# EAGLE design TRHHCHO_datalogger (EAGLE 9.1.1)
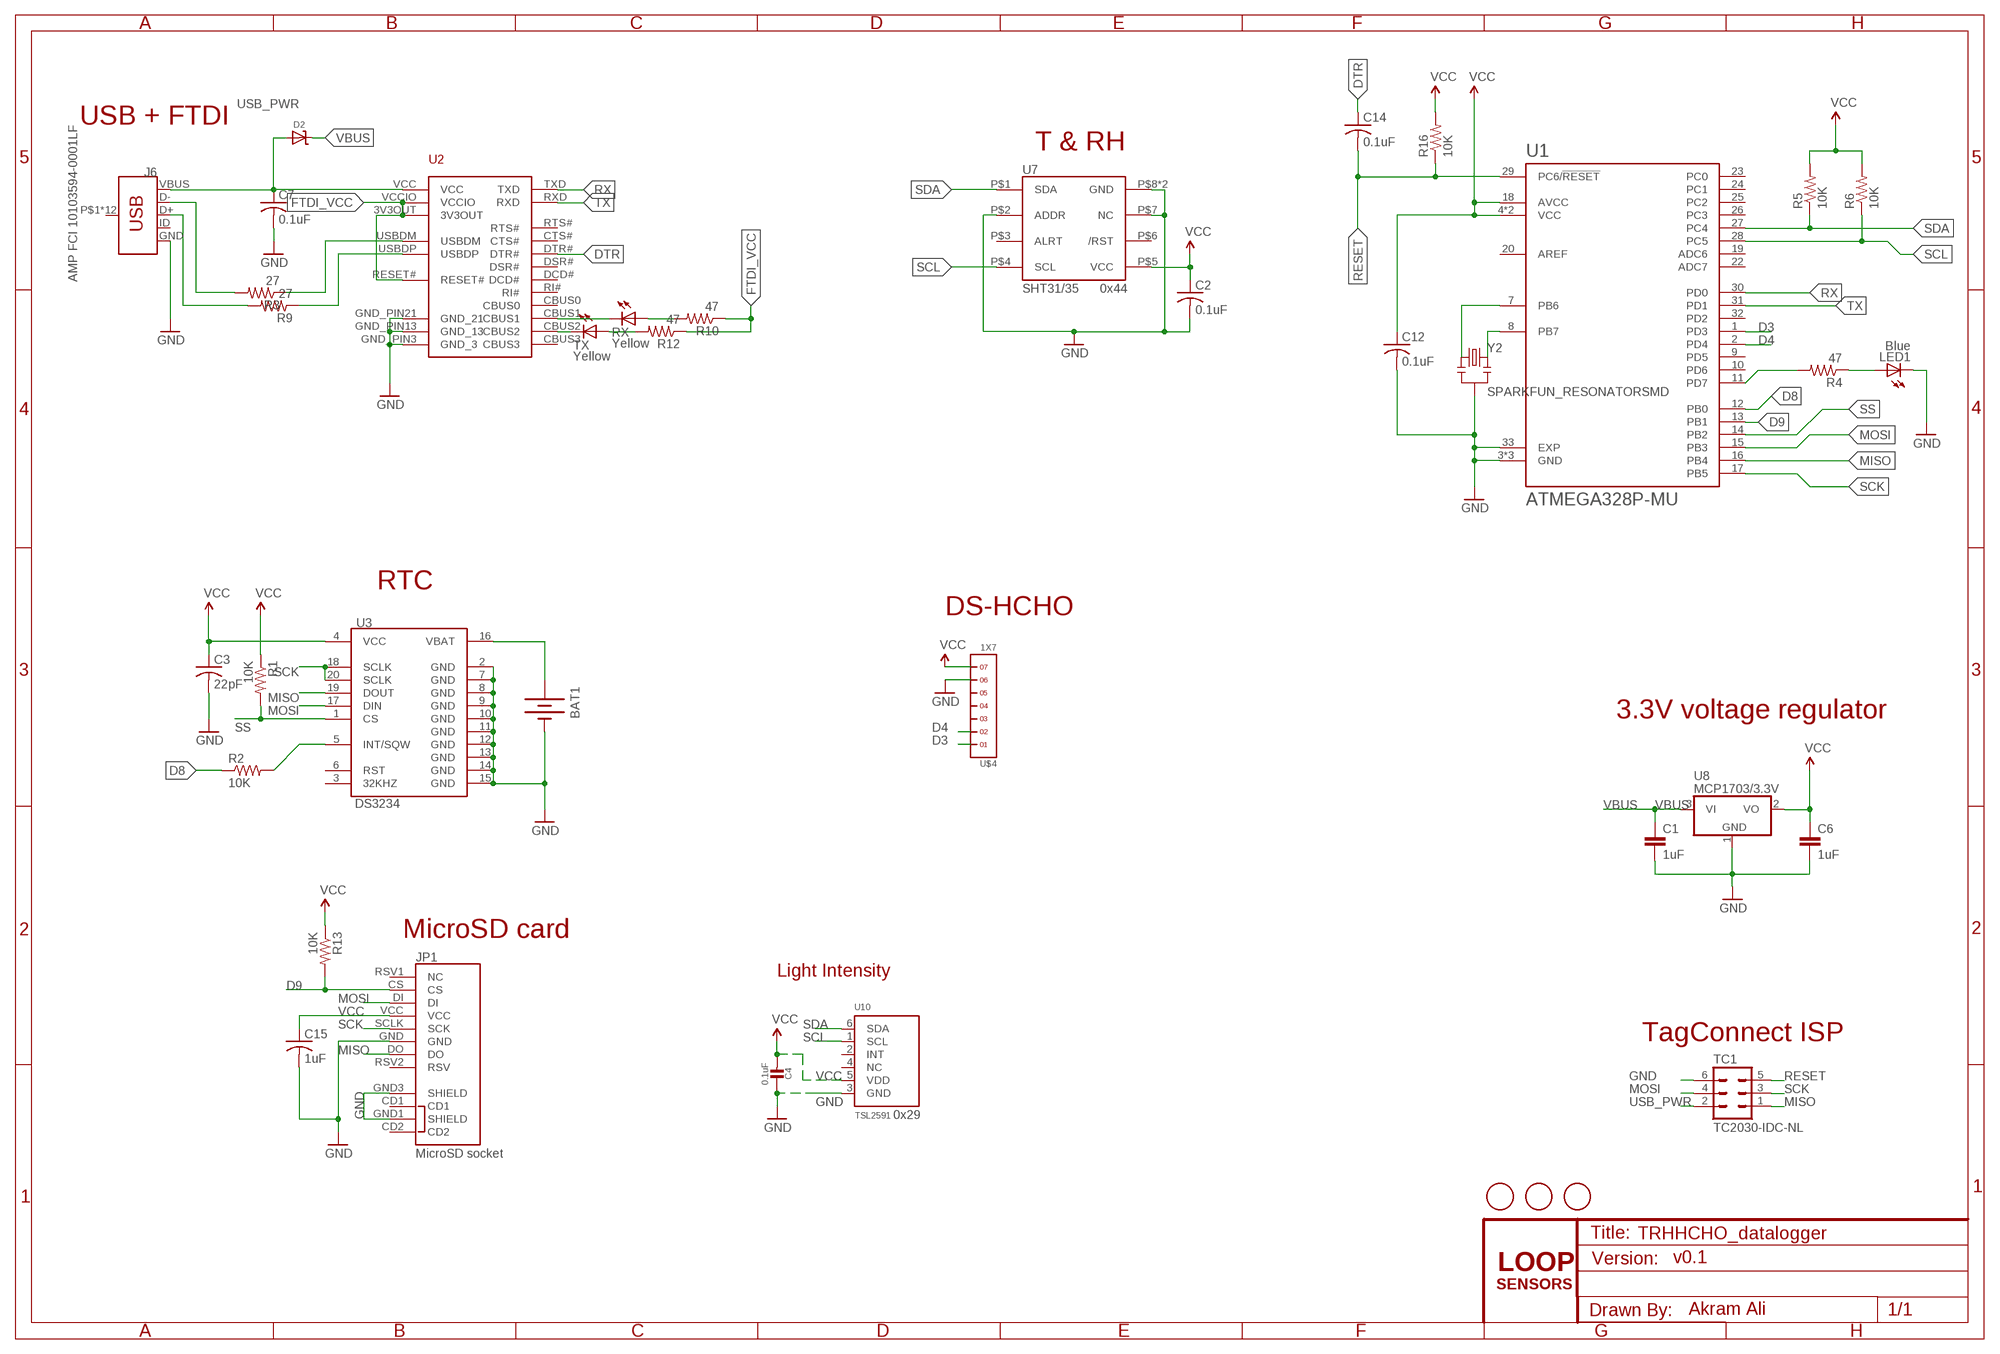
[diagram p0: schematic, sheet 1]

## Parts
BAT1  BATTERY12MM  [BATTCON_12MM]
C1  1uF  CAP0805  [0805]
C2  0.1uF  C-USC0402  [C0402]
C3  22pF  C-USC0402  [C0402]
C4  0.1uF  MICROBUILDER_CAP_CERAMIC_0402MP  [MICROBUILDER__0402MP]
C6  1uF  CAP0805  [0805]
C7  0.1uF  C-USC0402  [C0402]
C12  0.1uF  C-USC0402  [C0402]
C14  0.1uF  C-USC0402  [C0402]
C15  1uF  C-USC0402  [C0402]
D2  MICROBUILDER_DIODE-SCHOTTKYSOD-123  [MICROBUILDER_SOD-123]
J6  AMP FCI 10103594-0001LF  USB_MICRO-B_HALF_PTH  [USB-MICROB-PTH]
JP1  MicroSD socket  USD-SOCKETNEW  [MICRO-SD-SOCKET-PP]
LED1  Blue  LEDCHIPLED_0805  [CHIPLED_0805]
R1  10K  R-US_R0402  [R0402]
R2  10K  R-US_R0402  [R0402]
R3  27  R-US_R0402  [R0402]
R4  47  R-US_R0402  [R0402]
R5  10K  R-US_R0402  [R0402]
R6  10K  R-US_R0402  [R0402]
R9  27  R-US_R0402  [R0402]
R10  47  R-US_R0402  [R0402]
R12  47  R-US_R0402  [R0402]
R13  10K  R-US_R0402  [R0402]
R16  10K  R-US_R0402  [R0402]
RX  Yellow  LEDCHIPLED_0805  [CHIPLED_0805]
TC1  TC2030-IDC-NL  [TC2030-IDC-NL]
TX  Yellow  LEDCHIPLED_0805  [CHIPLED_0805]
U1  ATMEGA328P-MU  [QFN50P500X500X100-33N]
U2  FT231XQ-R  [FTDI_FT231XQ-R_PACKAGE]
U3  DS3234  [DS3234]
U7  SHT31/35  SHT31-DIS  [SHT3X]
U8  MCP1703/3.3V  MCP1703CB  [SOT23]
U10  TSL2591  LIGHT_TSL2591  [DFN6_TAOS]
U$1  FIDUCIAL  [FIDUCIAL_1MM]
U$2  FIDUCIAL  [FIDUCIAL_1MM]
U$3  FIDUCIAL  [FIDUCIAL_1MM]
U$4  1X7  [1X7]
Y2  SPARKFUN_RESONATORSMD  [SPARKFUN_RESONATOR-SMD]

## Nets
D3: U1.1(PD3) U$4.1
D4: U1.2(PD4) U$4.2
D8: R2.1 U1.12(PB0)
D9: JP1.CS R13.2 U1.13(PB1)
DTR: C14.1 U2.DTR#
FTDI_VCC: R10.1 R12.1 U2.3V3OUT U2.RESET# U2.VCCIO
GND: BAT1.GND(-) C1.2 C2.2 C3.2 C4.1 C6.2 C7.2 C12.2 C15.2 J6.GND JP1.GND JP1.GND1(SHIELD) JP1.GND3(SHIELD) LED1.C TC1.6 U1.3(GND) U1.5(GND) U1.21(GND) U1.33(EXP) U2.GND_PIN3(GND_3) U2.GND_PIN13(GND_13) U2.GND_PIN21(GND_21) U3.2(GND) U3.7(GND) U3.8(GND) U3.9(GND) U3.10(GND) U3.11(GND) U3.12(GND) U3.13(GND) U3.14(GND) U3.15(GND) U7.P$2(ADDR) U7.P$7(NC) U7.P$8(GND) U7.PAD(GND) U8.1(GND) U10.3(GND) U$4.6 Y2.2
MISO: JP1.DO TC1.1 U1.16(PB4) U3.19(DOUT)
MOSI: JP1.DI TC1.4 U1.15(PB3) U3.17(DIN)
N$1: R4.2 U1.11(PD7)
N$2: R2.2 U3.5(INT/SQW)
N$3: LED1.A R4.1
N$4: U1.8(PB7) Y2.3
N$5: U1.7(PB6) Y2.1
N$8: BAT1.PWR@1(+) U3.16(VBAT)
N$17: RX.C U2.CBUS1
N$18: TX.C U2.CBUS2
N$25: R3.1 U2.USBDM
N$26: R9.1 U2.USBDP
N$27: R10.2 RX.A
N$29: R12.2 TX.A
N$32: J6.D- R3.2
N$33: J6.D+ R9.2
RESET: C14.2 R16.1 TC1.5 U1.29(PC6/!RESET)
RX: U1.30(PD0) U2.TXD
SCK: JP1.SCLK(SCK) TC1.3 U1.17(PB5) U3.18(SCLK) U3.20(SCLK)
SCL: R6.1 U1.28(PC5) U7.P$4(SCL) U10.1(SCL)
SDA: R5.1 U1.27(PC4) U7.P$1(SDA) U10.6(SDA)
SS: R1.2 U1.14(PB2) U3.1(CS)
TX: U1.31(PD1) U2.RXD
USB_PWR: C7.1 D2.A J6.VBUS TC1.2 U2.VCC
VBUS: C1.1 D2.C U8.3(VI)
VCC: C2.1 C3.1 C4.2 C6.1 C12.1 C15.1 JP1.VCC R1.1 R5.2 R6.2 R13.1 R16.2 U1.4(VCC) U1.6(VCC) U1.18(AVCC) U3.4(VCC) U7.P$5(VCC) U8.2(VO) U10.5(VDD) U$4.7
Unconnected: J6.ID J6.P$1(SHIELD) J6.P$2(SHIELD) J6.P$3(SHIELD) J6.P$4(SHIELD) J6.P$6(SHIELD) J6.P$8(SHIELD) J6.P$10(SHIELD) J6.P$12(SHIELD) J6.SHEILD2(SHIELD) J6.SHIELD J6.SHIELD3(SHIELD) J6.SHIELD4(SHIELD) JP1.CD1 JP1.CD2 JP1.RSV1(NC) JP1.RSV2(RSV) U1.9(PD5) U1.10(PD6) U1.19(ADC6) U1.20(AREF) U1.22(ADC7) U1.23(PC0) U1.24(PC1) U1.25(PC2) U1.26(PC3) U1.32(PD2) U2.CBUS0 U2.CBUS3 U2.CTS# U2.DCD# U2.DSR# U2.RI# U2.RTS# U3.3(32KHZ) U3.6(RST) U7.P$3(ALRT) U7.P$6(/RST) U10.2(INT) U10.4(NC) U$4.3 U$4.4 U$4.5

## Notes on the sheet
- USB + FTDI
- T & RH
- 0x44
- RTC
- DS-HCHO
- 3.3V voltage regulator
- MicroSD card
- Light Intensity
- TagConnect ISP
- 0x29
- v0.1
- LOOP
- SENSORS
- Akram Ali

## Library data of the parts
BAT1 = SparkFun-Electromechanical:BATTERY: Battery Holders Various common sizes : AA, AAA, 18650 (PRT-12895), 20mm coin cell and 12mm coin cell. 20MM_4LEGS, BATT-10373; MPN: 3000; PROD_ID: BATT-08044
C1 C6 = SparkFun-Capacitors:CAP: Capacitor Standard 0603 ceramic capacitor, and 0.1" leaded capacitor.; MPN: CC0805KKX7R7BB105
C2 C3 C7 C12 C14 C15 = adafruit:C-US: CAPACITOR, American symbol
C4 = Adafruit Feather 32u4 Bluefruit LE:MICROBUILDER_CAP_CERAMIC: Ceramic Capacitors For new designs, use the packages preceded by an '_' character since they are more reliable: The following footprints should be used on most boards: _0402 - Standard footprint for regular board layouts _0603 - Standard footprint for regular board layouts _0805 - Standard footprint for regular board layouts _1206 - Standard footprint for regular board layouts For extremely tight-pitch boards where space is at a premium, the following 'micro-pitch' footprints can be used (smaller pads, no silkscreen outline, etc.): _0402MP - Micro-pitch footprint for very dense/compact boards _0603MP - Micro-pitch footprint for very dense/compact boards _0805MP - Micro-pitch footprint for very dense/compact boards _1206MP - Micro-pitch footprint for very dense/compact boards; MPN: GRM155R71C104KA88J
D2 = Adafruit Feather 32u4 Bluefruit LE:MICROBUILDER_DIODE-SCHOTTKY
J6 = SparkFun-Connectors:USB_MICRO-B: USB Type Micro-B Connector Male/female and PTH/SMT variants SparkFun Products: SparkFun microB USB Breakout <https://www.sparkfun.com/products/12035> SparkFun USB microB Plug Breakout <https://www.sparkfun.com/products/10031> SparkFun ESP8266 Thing <https://www.sparkfun.com/products/13231>; PROD_ID: CONN-13711
JP1 = SparkFun-Connectors:USD-SOCKET: microSD Socket Push-push type uSD socket. Schematic element and footprint production proven. Spark Fun Electronics SKU : PRT-00127. tDoc lines correctly indicate media card edge positions when inserting (unlocked, locked, depressed). NOTE: CD1 and CD2 are connected internally; PROD_ID: CONN-07820
LED1 = adafruit:LED: LED OSRAM: - CHIPLED LG R971, LG N971, LY N971, LG Q971, LY Q971, LO R971, LY R971 LH N974, LH R974 LS Q976, LO Q976, LY Q976 LO Q996 - Hyper CHIPLED LW Q18S LB Q993, LB Q99A, LB R99A - SideLED LS A670, LO A670, LY A670, LG A670, LP A670 LB A673, LV A673, LT A673, LW A673 LH A674 LY A675 LS A676, LA A676, LO A676, LY A676, LW A676 LS A679, LY A679, LG A679 - Hyper Micro SIDELED® LS Y876, LA Y876, LO Y876, LY Y876 LT Y87S - SmartLED LW L88C, LW L88S LB L89C, LB L89S, LG L890 LS L89K, LO L89K, LY L89K LS L896, LA L896, LO L896, LY L896 - TOPLED LS T670, LO T670, LY T670, LG T670, LP T670 LSG T670, LSP T670, LSY T670, LOP T670, LYG T670 LG T671, LOG T671, LSG T671 LB T673, LV T673, LT T673, LW T673 LH T674 LS T676, LA T676, LO T676, LY T676, LB T676, LH T676, LSB T676, LW T676 LB T67C, LV T67C, LT T67C, LS T67K, LO T67K, LY T67K, LW E67C LS E67B, LA E67B, LO E67B, LY E67B, LB E67C, LV E67C, LT E67C LW T67C LS T679, LY T679, LG T679 LS T770, LO T770, LY T770, LG T770, LP T770 LB T773, LV T773, LT T773, LW T773 LH T774 LS E675, LA E675, LY E675, LS T675 LS T776, LA T776, LO T776, LY T776, LB T776 LHGB T686 LT T68C, LB T68C - Hyper Mini TOPLED® LB M676 - Mini TOPLED Santana® LG M470 LS M47K, LO M47K, LY M47K Source: http://www.osram.convergy.de/; MPN: 150080BS75000
R1-R6 R9 R10 R12 R13 R16 = adafruit:R-US_: RESISTOR, American symbol
RX = adafruit:LED: LED OSRAM: - CHIPLED LG R971, LG N971, LY N971, LG Q971, LY Q971, LO R971, LY R971 LH N974, LH R974 LS Q976, LO Q976, LY Q976 LO Q996 - Hyper CHIPLED LW Q18S LB Q993, LB Q99A, LB R99A - SideLED LS A670, LO A670, LY A670, LG A670, LP A670 LB A673, LV A673, LT A673, LW A673 LH A674 LY A675 LS A676, LA A676, LO A676, LY A676, LW A676 LS A679, LY A679, LG A679 - Hyper Micro SIDELED® LS Y876, LA Y876, LO Y876, LY Y876 LT Y87S - SmartLED LW L88C, LW L88S LB L89C, LB L89S, LG L890 LS L89K, LO L89K, LY L89K LS L896, LA L896, LO L896, LY L896 - TOPLED LS T670, LO T670, LY T670, LG T670, LP T670 LSG T670, LSP T670, LSY T670, LOP T670, LYG T670 LG T671, LOG T671, LSG T671 LB T673, LV T673, LT T673, LW T673 LH T674 LS T676, LA T676, LO T676, LY T676, LB T676, LH T676, LSB T676, LW T676 LB T67C, LV T67C, LT T67C, LS T67K, LO T67K, LY T67K, LW E67C LS E67B, LA E67B, LO E67B, LY E67B, LB E67C, LV E67C, LT E67C LW T67C LS T679, LY T679, LG T679 LS T770, LO T770, LY T770, LG T770, LP T770 LB T773, LV T773, LT T773, LW T773 LH T774 LS E675, LA E675, LY E675, LS T675 LS T776, LA T776, LO T776, LY T776, LB T776 LHGB T686 LT T68C, LB T68C - Hyper Mini TOPLED® LB M676 - Mini TOPLED Santana® LG M470 LS M47K, LO M47K, LY M47K Source: http://www.osram.convergy.de/; MPN: LG R971-KN-1
TC1 = TagConnect:TC2030-IDC: Tag-Connect In Circuit Programming & Debug Cable 6 Pin http://www.tag-connect.com
TX = adafruit:LED: LED OSRAM: - CHIPLED LG R971, LG N971, LY N971, LG Q971, LY Q971, LO R971, LY R971 LH N974, LH R974 LS Q976, LO Q976, LY Q976 LO Q996 - Hyper CHIPLED LW Q18S LB Q993, LB Q99A, LB R99A - SideLED LS A670, LO A670, LY A670, LG A670, LP A670 LB A673, LV A673, LT A673, LW A673 LH A674 LY A675 LS A676, LA A676, LO A676, LY A676, LW A676 LS A679, LY A679, LG A679 - Hyper Micro SIDELED® LS Y876, LA Y876, LO Y876, LY Y876 LT Y87S - SmartLED LW L88C, LW L88S LB L89C, LB L89S, LG L890 LS L89K, LO L89K, LY L89K LS L896, LA L896, LO L896, LY L896 - TOPLED LS T670, LO T670, LY T670, LG T670, LP T670 LSG T670, LSP T670, LSY T670, LOP T670, LYG T670 LG T671, LOG T671, LSG T671 LB T673, LV T673, LT T673, LW T673 LH T674 LS T676, LA T676, LO T676, LY T676, LB T676, LH T676, LSB T676, LW T676 LB T67C, LV T67C, LT T67C, LS T67K, LO T67K, LY T67K, LW E67C LS E67B, LA E67B, LO E67B, LY E67B, LB E67C, LV E67C, LT E67C LW T67C LS T679, LY T679, LG T679 LS T770, LO T770, LY T770, LG T770, LP T770 LB T773, LV T773, LT T773, LW T773 LH T774 LS E675, LA E675, LY E675, LS T675 LS T776, LA T776, LO T776, LY T776, LB T776 LHGB T686 LT T68C, LB T68C - Hyper Mini TOPLED® LB M676 - Mini TOPLED Santana® LG M470 LS M47K, LO M47K, LY M47K Source: http://www.osram.convergy.de/; MPN: LH R974-LP-1
U1 = ATMEGA328P-MU:ATMEGA328P-MU: ATmega Series 20 MHz 32 KB Flash 2 KB SRAM 8-Bit Microcontroller - QFN-32; AVAILABILITY: Good; DESCRIPTION: ATmega Series 20 MHz 32 KB Flash 2 KB SRAM 8-Bit Microcontroller - QFN-32; MF: Atmel; MP: ATMEGA328P-MU; PACKAGE: QFN-32 Atmel; PRICE: 2.55 USD
U2 = ftdi_ft231xq-r:FT231XQ-R: This is the 20-LD QFN package of the FTDI FT231XQ-R chip.; MPN: FT231XQ-R
U3 = SparkFun-FreqCtrl:DS3234: SPI RTC module with battery backup and internal clock.; MPN: DS3234S#
U7 = thomasb9511:SHT31-DIS; MPN: SHT31-DIS-B
U8 = linear:MCP1703: 250 mA, 16V, Low Quiescent Current LDO Regulator Source: http://ww1.microchip.com/downloads/en/DeviceDoc/22049b.pdf; MPN: MCP1703T-2502E/CB
U10 = TSL2591:LIGHT_TSL2591: TSL2591 Light-To-Digital Sensor; MPN: TSL25911FN
U$1-U$3 = adafruit:FIDUCIAL: For use by pick and place machines to calibrate the vision/machine, 1mm By microbuilder.eu
U$4 = headers(2mm):1X7
Y2 = Adafruit Feather 32u4 Bluefruit LE:SPARKFUN_RESONATOR: Resonator Small SMD resonator. This is the itty bitty 10/20MHz resonators with built in caps. CSTCE10M0G55 and CSTCE20M0V53. Footprint has been reviewed closely but hasn't been tested yet.

## Board
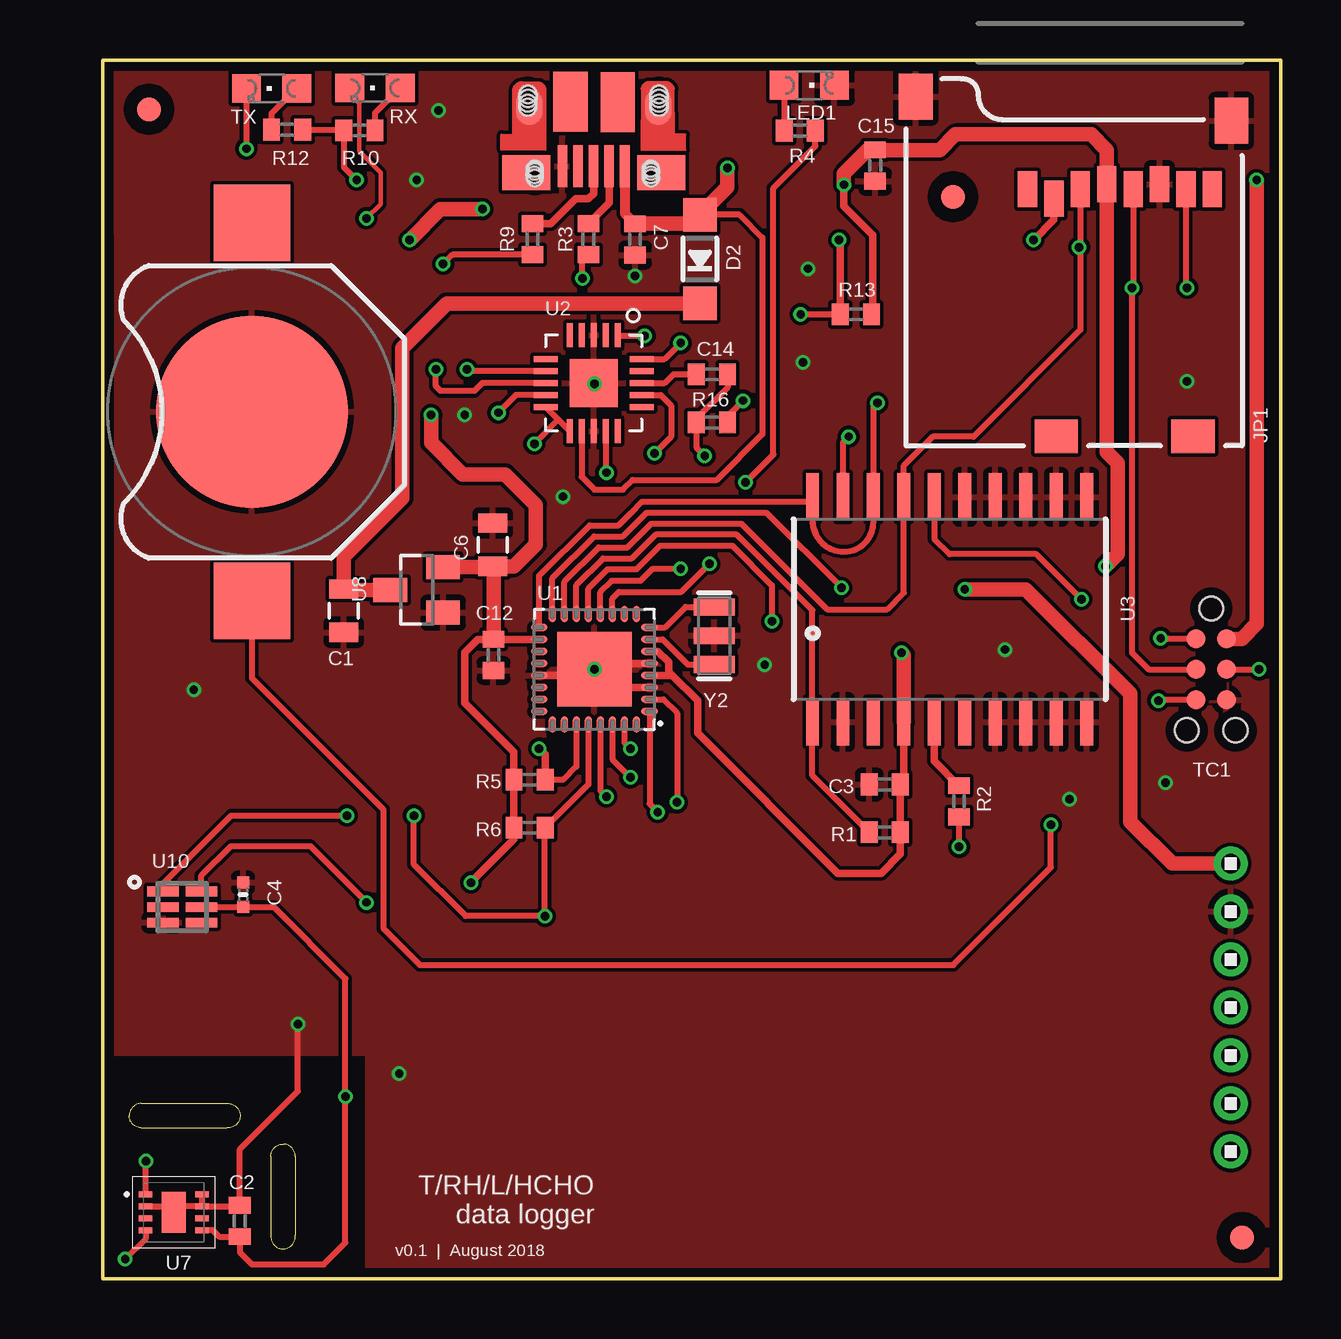
[diagram p1: board, top side]
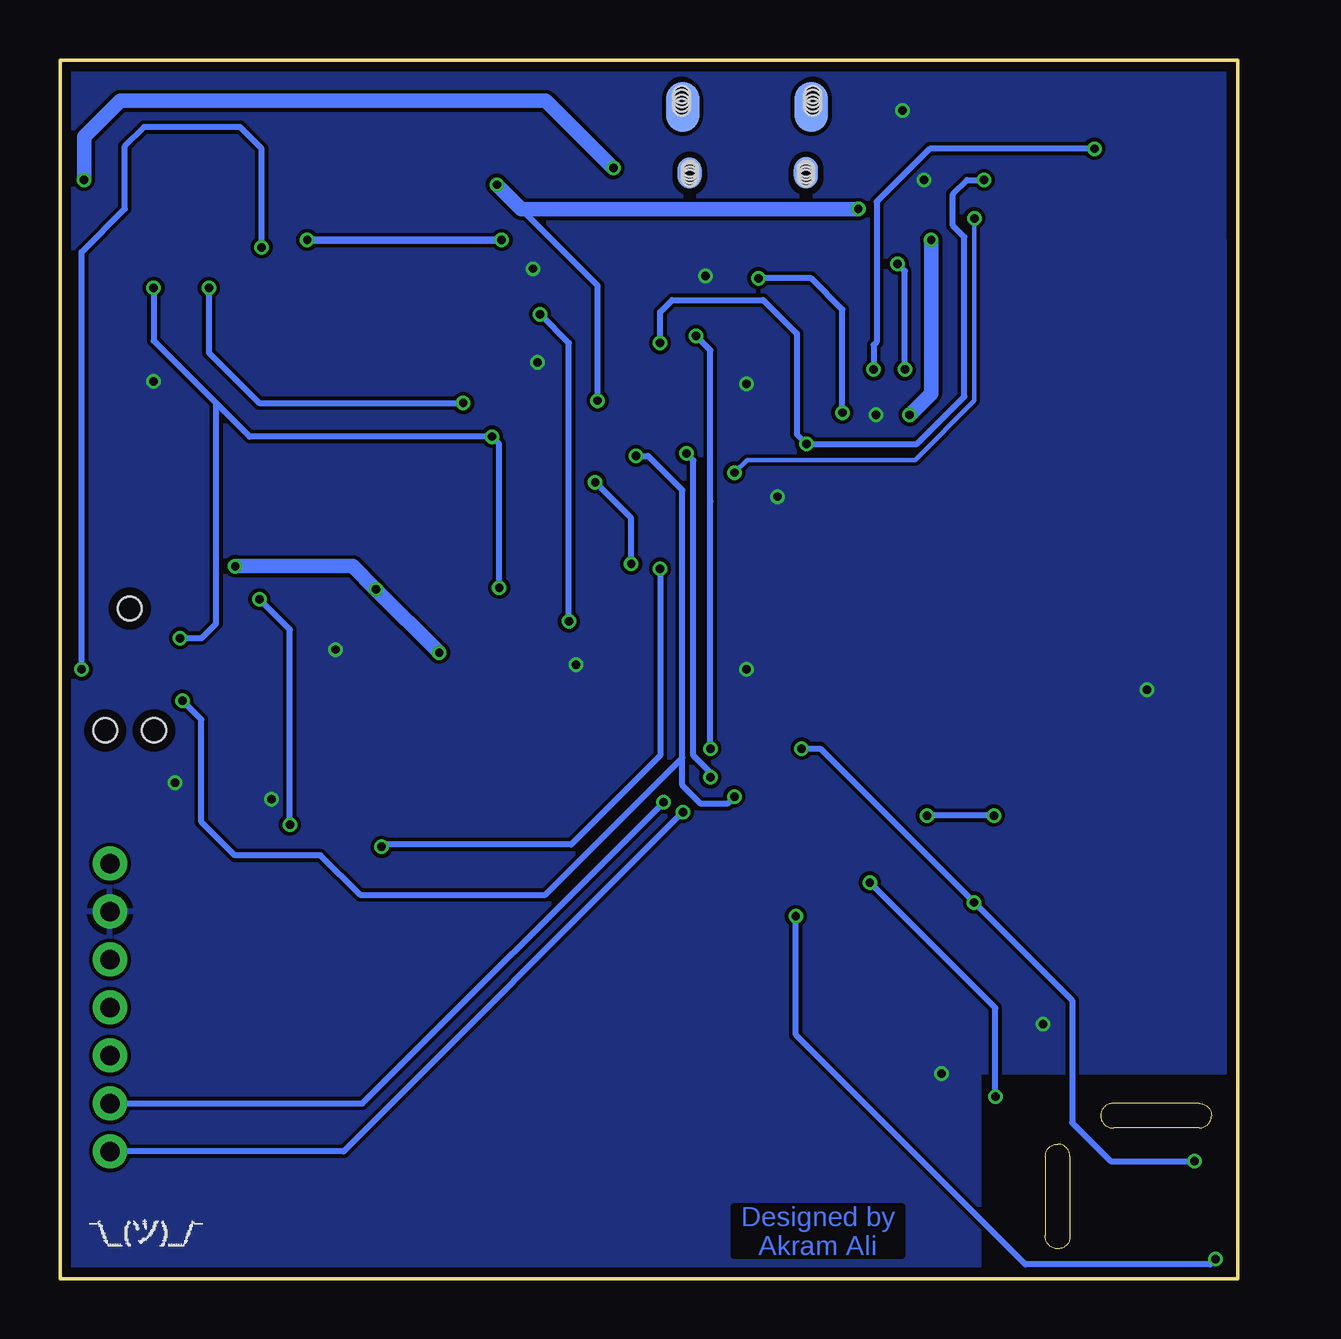
[diagram p2: board, bottom side, seen from below]

Size 49.07 x 50.8 mm. Coordinates in mm from the lower left corner, seen from the top.
Outline: 1.6,6.29 arc-90 1.09,6.8 arc-90 1.6,7.3 5.21,7.3 arc-90 5.71,6.8 arc-95 5.16,6.29 1.6,6.29
Outline: 8.01,5.1 arc90 7.5,5.61 arc90 6.99,5.1 6.99,1.75 arc90 7.5,1.24 arc95 8.01,1.8 8.01,5.1
Outline: 0,43.43 0,0 49.07,0 49.07,50.8 0,50.8 0,43.43
Copper layers (1*16): Top 0.035559375mm / dielectric 1.6mm / Bottom 0.035559375mm
Design rules "oshpark-2layer": minimum track width 6mil, minimum drill 10mil, track to track 6mil, track to pad 6mil, pad to pad 6mil, via to via 6mil, smd to smd 6mil, copper to edge 15mil, drill to drill 6mil, minimum pad ring 5mil, minimum via ring 5mil, stop-mask expansion 2.5mil, vias tented up to drill 0mil, thermal gap 10mil

### Footprints (pad centres in the part's own frame; a part is rotated, then mirrored left to right if it is on the bottom)
BATTCON_12MM = smd 8 x 8: GND 0,0 | smd 3.175 x 3.175: PWR@1 -7.874,0; PWR@2 7.874,0
0805 = smd 0.8 x 1.2: 1 -0.9,0; 2 0.9,0
C0402 = smd 0.7 x 0.9: 1 -0.65,0; 2 0.65,0
MICROBUILDER__0402MP = smd 0.5 x 0.5: 1 -0.508,0; 2 0.508,0
MICROBUILDER_SOD-123 = smd 1.4 x 1.4: A 1.85,0; C -1.85,0
USB-MICROB-PTH = smd 0.4 x 1.75: D+ 0.031,1.331; D- -0.619,1.331; GND 1.331,1.331; ID 0.681,1.331; VBUS -1.269,1.331 | smd 1.4 x 2.1 bottom: P$1 2.701,-1.142; P$3 -2.659,-1.144 | smd 1 x 1.3: P$2 2.487,1.594; P$6 -2.368,1.604 | smd 1 x 1.3 bottom: P$4 -2.368,1.604; P$10 2.481,1.598 | smd 1.1 x 1.5: P$8 2.701,-1.142; P$12 -2.659,-1.144 | smd 2 x 1.46: SHEILD2 2.831,1.606; SHIELD -2.794,1.606 | smd 1.425 x 2.5: SHIELD3 -0.979,-1.349; SHIELD4 0.996,-1.352 | hole 0.7: -2.693,-1.134; -2.693,-1.3; -2.694,-1.499; -2.694,-1.664; 2.768,-1.134; 2.767,-1.303; 2.766,-1.496; 2.766,-1.664 | hole 0.66: -2.359,1.821; -2.349,1.691; -2.359,1.541; -2.354,1.432; 2.481,1.821; 2.491,1.691; 2.481,1.541; 2.486,1.432
MICRO-SD-SOCKET-PP = smd 1.8 x 1.4: CD1 -2.05,0.4; CD2 -7.75,0.4 | smd 0.8 x 1.5: CS -7.84,10.3; DI -6.74,10.7; DO -2.34,10.7; GND -3.44,10.9; RSV1 -8.94,10.7; RSV2 -1.24,10.7; SCLK -4.54,10.7; VCC -5.64,10.9 | smd 1.4 x 1.9: GND1 -13.6,14.55; GND3 -0.45,13.55
CHIPLED_0805 = smd 1.2 x 1.2: A 0,-1.05; C 0,1.05
R0402 = smd 0.7 x 0.9: 1 -0.65,0; 2 0.65,0
TC2030-IDC-NL = smd 0.787 x 0.787: 1 -1.27,-0.635; 2 -1.27,0.635; 3 0,-0.635; 4 0,0.635; 5 1.27,-0.635; 6 1.27,0.635 | hole 0.991: -2.54,0; 2.54,1.016; 2.54,-1.016
QFN50P500X500X100-33N = smd 0.7 x 0.3: 1 -2.3,1.75; 2 -2.3,1.25; 3 -2.3,0.75; 4 -2.3,0.25; 5 -2.3,-0.25; 6 -2.3,-0.75; 7 -2.3,-1.25; 8 -2.3,-1.75; 17 2.3,-1.75; 18 2.3,-1.25; 19 2.3,-0.75; 20 2.3,-0.25; 21 2.3,0.25; 22 2.3,0.75; 23 2.3,1.25; 24 2.3,1.75 | smd 0.3 x 0.7: 9 -1.75,-2.3; 10 -1.25,-2.3; 11 -0.75,-2.3; 12 -0.25,-2.3; 13 0.25,-2.3; 14 0.75,-2.3; 15 1.25,-2.3; 16 1.75,-2.3; 25 1.75,2.3; 26 1.25,2.3; 27 0.75,2.3; 28 0.25,2.3; 29 -0.25,2.3; 30 -0.75,2.3; 31 -1.25,2.3; 32 -1.75,2.3 | smd 3.1 x 3.1: 33 0,0
FTDI_FT231XQ-R_PACKAGE = smd 0.25 x 1: 3V3OUT 0.968,-2.032; CBUS2 -0.532,-2.032; CBUS3 0.968,1.968; CTS# -1.032,-2.032; DTR# -0.032,1.968; RTS# -0.532,1.968; TXD 0.468,1.968; USBDM 0.468,-2.032; USBDP -0.032,-2.032; VCCIO -1.032,1.968 | smd 1 x 0.25: CBUS0 1.968,0.968; CBUS1 1.968,0.468; DCD# -2.032,-1.032; DSR# -2.032,-0.532; GND_PIN3 -2.032,-0.032; GND_PIN13 1.968,-0.032; RESET# 1.968,-1.032; RI# -2.032,0.468; RXD -2.032,0.968; VCC 1.968,-0.532 | smd 2 x 2: GND_PIN21 -0.032,-0.032
DS3234 = smd 0.53 x 1.98: 1 -5.715,-4.685; 2 -4.445,-4.685; 3 -3.175,-4.685; 4 -1.905,-4.685; 5 -0.635,-4.685; 6 0.635,-4.685; 7 1.905,-4.685; 8 3.175,-4.685; 9 4.445,-4.685; 10 5.715,-4.685; 11 5.715,4.685; 12 4.445,4.685; 13 3.175,4.685; 14 1.905,4.685; 15 0.635,4.685; 16 -0.635,4.685; 17 -1.905,4.685; 18 -3.175,4.685; 19 -4.445,4.685; 20 -5.715,4.685
SHT3X = smd 0.55 x 0.25: P$1 -1.175,0.75; P$2 -1.175,0.25; P$3 -1.175,-0.25; P$4 -1.175,-0.75; P$5 1.175,-0.75; P$6 1.175,-0.25; P$7 1.175,0.25; P$8 1.175,0.75 | smd 1 x 1.7: PAD 0,0
SOT23 = smd 1 x 1.4: 1 -0.95,-1.1; 2 0.95,-1.1; 3 0,1.1
DFN6_TAOS = smd 1.3 x 0.4: 1 -0.8,0.65; 2 -0.8,0; 3 -0.8,-0.65; 4 0.8,-0.65; 5 0.8,0; 6 0.8,0.65
FIDUCIAL_1MM = smd 1 x 1: 1 0,0
1X7 = drill 0.8 pad 1.422: 1 -6,0; 2 -4,0; 3 -2,0; 4 0,0; 5 2,0; 6 4,0; 7 6,0
SPARKFUN_RESONATOR-SMD = smd 0.7 x 1.7: 1 -1.2,0; 2 0,0; 3 1.2,0

### Placement (x,y rotation side)
BAT1  6.2,36.13 90 top
C1  10.03,27.84 270 top
C2  5.7,2.41 90 top
C3  32.57,20.6 180 top
C4  5.84,16 270 top
C6  16.24,30.59 90 top
C7  22.17,43.32 270 top
C12  16.27,26 270 top
C14  25.37,37.7 0 top
C15  32.17,46.4 270 top
D2  24.87,42.5 90 top
J6  20.47,47.7 180 top
JP1  47.46,34.72 0 top
LED1  29.43,49.74 270 top
R1  32.57,18.6 180 top
R2  35.67,19.9 90 top
R3  20.22,43.33 90 top
R4  29.03,47.85 0 top
R5  17.77,20.8 180 top
R6  17.77,18.8 180 top
R9  17.9,43.33 90 top
R10  10.68,47.86 0 top
R12  7.67,47.89 180 top
R13  31.37,40.2 180 top
R16  25.37,35.69 0 top
RX  11.33,49.63 90 top
TC1  46.17,25.4 270 top
TX  7.03,49.62 90 top
U1  20.47,25.4 180 top
U2  20.48,37.3 270 top
U3  35.27,27.9 0 top
U7  2.95,2.77 0 top
U8  13.07,28.71 90 top
U10  3.3,15.49 0 top
U$1  1.92,48.74 0 top
U$2  35.42,45.1 0 top
U$3  47.46,1.72 0 top
U$4  46.99,11.3 90 top
Y2  25.47,26.8 90 top

### Tracks (layer width: path | path; a pad name or v marks a point on that pad's centre or on a via)
D3  (via drill 0.35)
  Top 0.254: U1.1 22.77,19.79 v23.11,19.45
  Bottom 0.254: v23.11,19.45 37.26,5.3 U$4.1
D4  (via drill 0.35)
  Top 0.254: v23.92,19.86 23.92,23.58 23.35,24.15 U1.2
  Bottom 0.254: U$4.2 36.47,7.3 v23.92,19.86
D8  (via drill 0.35)
  Top 0.254: U1.12 20.72,28.62 21.19,29.08 22.39,29.08 22.91,29.6 v24.07,29.6 | R2.1 v35.67,18.01 v35.67,18
  Bottom 0.254: v24.07,29.6 24.07,21.8 27.77,18.1 35.57,18.1 v35.67,18
D9  (via drill 0.35, 0.35 pad 0.13)
  Top 0.254: U1.13 20.22,28.76 21.03,29.57 22.23,29.57 23.22,30.56 26.22,30.56 27.88,28.9 v27.88,27.4 v27.87,27.4 | v29.07,40.2 R13.2
  Top 0.305: JP1.CS 39.62,44.15 v38.77,43.3 | R13.2 30.72,43.25 v30.67,43.3
  Bottom 0.254: v27.87,27.4 27.87,39 v29.07,40.2
  Bottom 0.305: v38.77,43.3 v30.67,43.3
DTR
  Top 0.178: C14.1
  Top 0.254: U2.DTR# 23.4,37.33 23.77,37.7 C14.1
FTDI_VCC  (via drill 0.35 pad 0.13)
  Top 0.254: U2.3V3OUT 18.97,35.8 | 18.97,35.8 U2.RESET# | U2.VCCIO 23.4,38.33 v24.07,39 | R12.1 10,47.89 R10.1 10.03,46.34 v10.57,45.8 | 18.97,35.8 v17.97,34.8
  Bottom 0.254: v24.07,39 24.07,40.3 23.57,40.8 19.77,40.8 18.37,39.4 18.37,35.2 v17.97,34.8 13.36,34.8 11.39,36.77 11.39,43.42 11.87,43.9 11.87,45.2 11.27,45.8 v10.57,45.8
GND  (via drill 0.35 pad 0.13)
  Top 0.254: U7.P$2 2.7,3.02 U7.PAD 3.2,3.02 U7.P$7 | U7.P$8 U7.P$7 | U7.P$7 5.67,3.02 C2.2 5.7,5.4 8.12,7.82 v8.12,10.61
  Top 0.305: U1.21 20.22,25.15 U1.33 | U1.3 21.22,24.65 U1.33 | U1.5 20.72,25.65 U1.33
  other vias: 20.47,37.3 22.17,41.8 3.78,24.56 12.34,8.54 40.27,19.99 20.47,25.4 13.97,48.7 29.17,38.2 45.17,37.4 37.59,26.23 44.28,20.68 27.57,25.6 29.37,42.1 15.07,36 19.17,32.6 13.07,45.8
  pour Top: -0.63,51.69 50.04,51.69 50.04,-2.54 11.05,-2.54 11.05,9.4 -0.63,9.4
  pour Bottom: -0.76,51.94 50.29,51.94 50.29,-2.79 10.79,-2.79 10.79,8.64 -0.89,8.64 -0.89,51.94
MISO  (via drill 0.35, 0.35 pad 0.13)
  Top 0.254: JP1.DO 45.12,41.35 v45.17,41.3 | U3.19 30.83,34.86 v31.07,35.1 | U1.16 18.72,29.2 20.46,30.94 21.66,30.94 22.65,31.93 27.64,31.93 v30.77,28.8 | v44.07,26.7 44.1,26.67 TC1.1
  Bottom 0.254: v45.17,41.3 45.17,39.1 42.82,36.75 | 42.82,36.75 41.17,35.1 v31.07,35.1 30.77,34.8 v30.77,28.8 | v44.07,26.7 43.17,26.7 42.57,27.3 42.57,36.5 42.82,36.75
MOSI  (via drill 0.35 pad 0.13)
  Top 0.254: JP1.DI 40.72,43.55 40.72,43.04 | U1.15 19.22,29.06 20.65,30.49 21.85,30.49 22.84,31.47 26.6,31.47 30.17,27.9 32.67,27.9 33.37,28.6 U3.17 33.37,33.9 34.57,35.1 36.27,35.1 40.72,39.55 40.72,43.04 | 40.72,43.04 v40.67,42.99 | TC1.4 v48.17,25.4
  Bottom 0.254: v40.67,42.99 40.67,47.1 41.57,48 45.57,48 46.37,47.2 46.37,44.6 48.17,42.8 v48.17,25.4
N$1  (via drill 0.35 pad 0.13)
  Top 0.254: U1.11 21.22,28.35 21.5,28.63 24.1,28.63 24.78,29.31 v25.27,29.8 | v26.77,33.2 27.93,34.36 27.93,45.46 29.68,47.21 R4.2
  Bottom 0.254: v25.27,29.8 25.27,31.7 v26.77,33.2
N$2
  Top 0.305: U3.5 34.64,21.57 R2.2
N$3
  Top 0.254: LED1.A R4.1
N$4
  Top 0.254: U1.8 23.42,27.15 24.27,28 Y2.3
N$5
  Top 0.254: U1.7 23.32,26.65 24.37,25.6 Y2.1
N$8  (via drill 0.35)
  Top 0.254: U3.16 34.64,30.83 35.27,30.2 38.89,30.2 v40.77,28.32 | BAT1.PWR@1 6.21,25.04 11.68,19.56 11.68,14.61 13.21,13.08 35.43,13.08 39.5,17.14 v39.5,18.92
  Bottom 0.254: v40.77,28.32 39.5,27.05 v39.5,18.92
N$17  (via drill 0.35 pad 0.13)
  Top 0.178: RX.C 10.28,49.39 10.67,49 10.67,48.94 10.68,48.94 10.68,46.99 11.57,46.09 11.57,44.8 v10.97,44.2
  Top 0.254: U2.CBUS1 20.94,33.63 v20.97,33.6
  Bottom 0.178: v10.97,44.2 10.97,36.6 13.44,34.13 20.44,34.13 v20.97,33.6
N$18  (via drill 0.35 pad 0.13)
  Top 0.254: TX.C v5.98,47.1 v5.97,47.1 | U2.CBUS2 15.24,37.83 v15.17,37.9
  Bottom 0.254: v5.97,47.1 12.83,47.1 15.04,44.88 15.04,39.04 15.17,38.92 v15.17,37.9
N$25  (via drill 0.35 pad 0.13)
  Top 0.254: v19.97,41.7 19.97,42.43 R3.1 | U2.USBDM 17.2,36.83 v16.47,36.1
  Bottom 0.254: v16.47,36.1 16.47,40.4 17.77,41.7 v19.97,41.7
N$26  (via drill 0.35 pad 0.13)
  Top 0.254: v13.87,37.9 13.87,37.2 14.07,37 15.47,37 15.8,37.33 U2.USBDP | R9.1 14.55,42.68 v14.17,42.3
  Bottom 0.254: v13.87,37.9 13.87,42 v14.17,42.3
N$27
  Top 0.254: R10.2 11.33,48.58 RX.A
N$29
  Top 0.254: R12.2 7.02,48.56 TX.A
N$32
  Top 0.305: R3.2 21.1,44.85 21.09,44.86 J6.D-
N$33
  Top 0.305: R9.2 18.66,43.98 19.7,45.02 20.23,45.02 20.44,45.23 J6.D+
RESET  (via drill 0.35 pad 0.13)
  Top 0.254: U1.29 20.72,20.35 v20.97,20.1 | C14.2 26.02,37.15 24.72,35.85 R16.1 24.72,34.65 v25.07,34.3 | TC1.5 44,24.13 v43.97,24.1
  Bottom 0.254: v25.07,34.3 24.57,34.3 23.14,32.87 23.14,21.71 | v20.97,20.1 21.27,19.8 22.37,19.8 23.14,20.57 23.14,21.71 | 23.14,21.71 28.85,16 36.57,16 38.23,17.65 41.78,17.65 43.18,19.05 43.18,23.31 v43.97,24.1
RX  (via drill 0.35 pad 0.13)
  Top 0.254: U2.TXD 23.24,36.83 23.67,36.4 23.67,35.1 v22.97,34.4 | U1.30 21.22,21.65 v21.97,20.9
  Bottom 0.254: v21.97,20.9 21.97,21.1 22.68,21.81 22.68,34.11 v22.97,34.4
SCK  (via drill 0.35)
  Top 0.254: v32.27,36.5 32.1,36.33 U3.18 32.1,31.53 arc-90 30.87,30.3 arc-90 29.56,31.61 U3.20 29.36,32.39 22.46,32.39 21.98,31.91 21.47,31.4 20.27,31.4 18.17,29.3 U1.17 | TC1.3 43.57,25.4 42.87,26.1 v42.87,41.3 42.92,41.35 JP1.SCLK
  Bottom 0.254: v42.87,41.3 42.87,38.6 40.77,36.5 v32.27,36.5
SCL  (via drill 0.35)
  Top 0.254: U1.28 20.22,20.6 R6.1 v18.41,15.11 15.11,15.11 12.95,17.27 v12.95,19.3 | U7.P$4 1.77,1.67 v0.93,0.83 | U10.1 2.5,16.47 5.33,19.3 v10.16,19.3
  Bottom 0.254: v0.93,0.83 1.15,0.6 8.84,0.6 18.41,10.17 v18.41,15.11 | v10.16,19.3 v12.95,19.3
SDA  (via drill 0.35, 0.35 pad 0.13)
  Top 0.254: U1.27 19.72,21.35 19.17,20.8 R5.1 | U7.P$1 1.77,4.87 v1.8,4.9 | U10.6 4.1,16.8 5.33,18.03 8.64,18.03 v10.98,15.68
  Top 0.305: R5.1 18.42,21.85 v18.17,22.1
  Bottom 0.254: v1.8,4.9 5.3,4.9 6.9,6.5 6.9,11.6 v10.98,15.68 17.4,22.1 v18.17,22.1
SS
  Top 0.254: R1.2 29.56,20.97 U3.1 29.56,27.87 26.41,31.01 23.03,31.01 22.04,30.03 20.84,30.03 19.72,28.91 U1.14
TX  (via drill 0.35 pad 0.13)
  Top 0.178: 21.48,39.3 U2.RXD
  Top 0.254: U1.31 21.72,22.61 21.72,22.35 v21.97,22.1 | v22.57,39.3 21.48,39.3
  Bottom 0.254: v21.97,22.1 21.97,32.4 21.97,38.7 v22.57,39.3
USB_PWR  (via drill 0.35 pad 0.13)
  Top 0.254: D2.A 26.52,44.35 27.47,43.4 27.47,35.2 25.57,33.3 22.07,33.3 21.66,32.89 20.48,32.89 19.94,33.43 U2.VCC
  Top 0.406: J6.VBUS 21.74,44.4 C7.1
  Top 0.61: TC1.2 47.44,26.67 48.07,27.3 v48.07,45.8 | C7.1 24.49,43.97 D2.A 26.02,45.49 v26.02,46.29
  Bottom 0.61: v48.07,45.8 48.07,47.6 46.57,49.1 28.82,49.1 v26.02,46.29
VBUS
  Top 0.61: D2.C 15.75,40.65 14.32,40.65 12.47,38.8 12.47,35.2 | 12.47,35.2 | 12.47,35.2 12.47,32.54 10.03,30.09 C1.1 10.06,28.71 U8.3
VCC  (via drill 0.35, 0.35 pad 0.13)
  Top 0.254: U7.P$5 4.58,2.02 4.84,1.76 C2.1 5.7,1.1 6.2,0.6 9.2,0.6 10.1,1.5 v10.1,7.6 10.1,12.51 7.11,15.49 C4.2 U10.5 | 33.37,20.75 C3.1 | R16.2 26.02,35.95 v26.67,36.6
  Top 0.305: U1.18 C12.1 | C12.1 15.62,26.65 15.07,26.1 15.07,24 17.12,21.95 R5.2 R6.2 17.12,18.31 v15.33,16.52 | 33.37,20.75 U3.4 | C3.1 R1.1 33.22,17.71 32.42,16.9 30.62,16.9 24.77,22.74 24.77,24.1 23.72,25.15 | 23.72,25.15 U1.4 | U1.6 23.12,26.15 23.57,25.7 23.57,25.3 23.72,25.15 | v30.87,45.6 30.87,44.7 32.07,43.5 32.07,40.25
  Top 0.406: C12.1 | 32.07,40.25 R13.1
  Top 0.61: v15.81,44.58 14.06,44.58 v12.77,43.3 | U3.4 33.37,26 v33.27,26.1 | v41.77,29.7 42.27,30.2 42.27,34 41.82,34.45 JP1.VCC 41.82,47.05 41.17,47.7 35.51,47.7 34.86,47.05 C15.1 31.87,47.05 30.87,46.05 v30.87,45.6 | U8.2 16.21,29.66 | 16.21,29.66 C6.1 17.12,29.69 18.03,30.61 18.03,32.26 16.76,33.53 14.99,33.53 13.67,34.84 v13.67,36 | 16.21,29.66 16.27,29.6 C12.1 | U$4.7 44.55,17.3 42.8,19.05 42.8,24.38 38.45,28.73 v35.91,28.73
  Bottom 0.254: v10.1,7.6 10.1,11.28 v15.33,16.52 | v26.67,36.6 26.67,41.4 v30.87,45.6
  Bottom 0.61: v15.81,44.58 29.86,44.58 v30.87,45.6 | v12.77,43.3 12.77,36.9 v13.67,36 | v41.77,29.7 36.87,29.7 v35.91,28.73 v33.27,26.1

### Text on the board
Bottom: Designed by / Akram Ali
_tsilk: T/RH/L/HCHO / data logger | v0.1 | August 2018